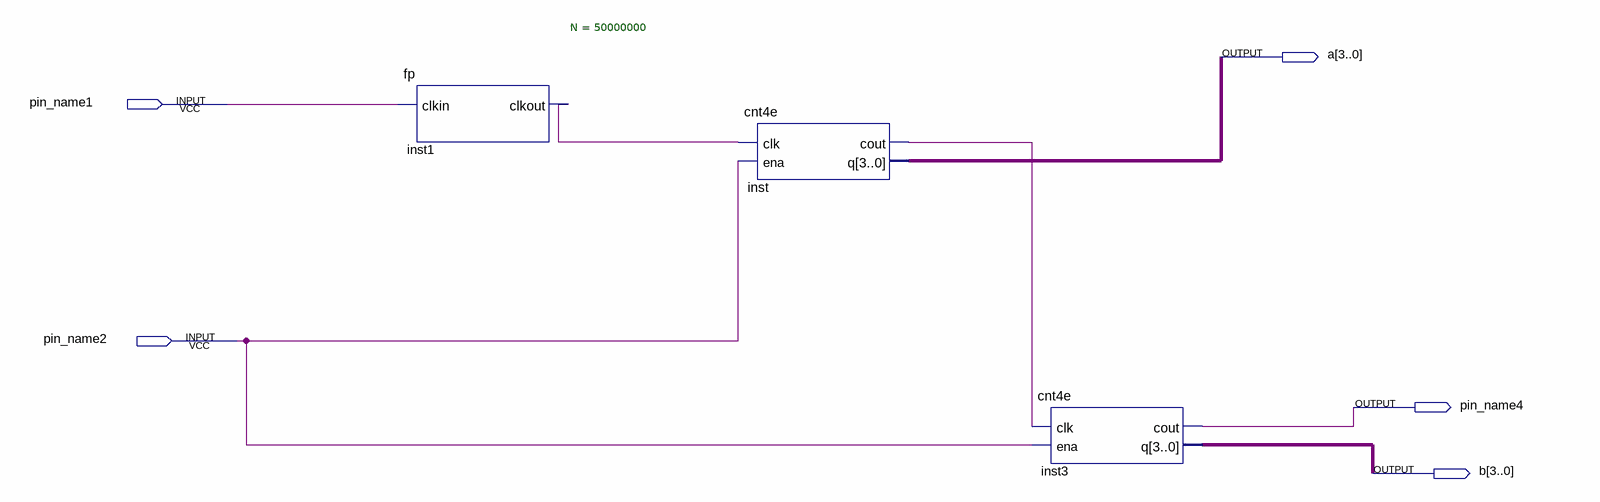
[diagram p0: schematic sheet]
// Quartus schematic total.bdf as structural Verilog: 3 symbols, 5 pins
module total (
  input  pin_name1,
  input  pin_name2,
  output [3:0] a,
  output pin_name4,
  output [3:0] b
);

  wire inst1_clkout, inst_cout;

  fp #(.N(50000000)) inst1 (.clkin(pin_name1), .clkout(inst1_clkout));
  cnt4e inst (.clk(inst1_clkout), .ena(pin_name2), .cout(inst_cout), .q(a));
  cnt4e inst3 (.clk(inst_cout), .ena(pin_name2), .cout(pin_name4), .q(b));
endmodule
